# Altium schematic sheet TI_92_power.SchDoc: Power
size A; Organization: Altium Limited; Address1: L3, 12a Rodborough Rd; Address2: Frenchs Forest; Address3: NSW; Address4: Australia 2086; SheetNumber: 2
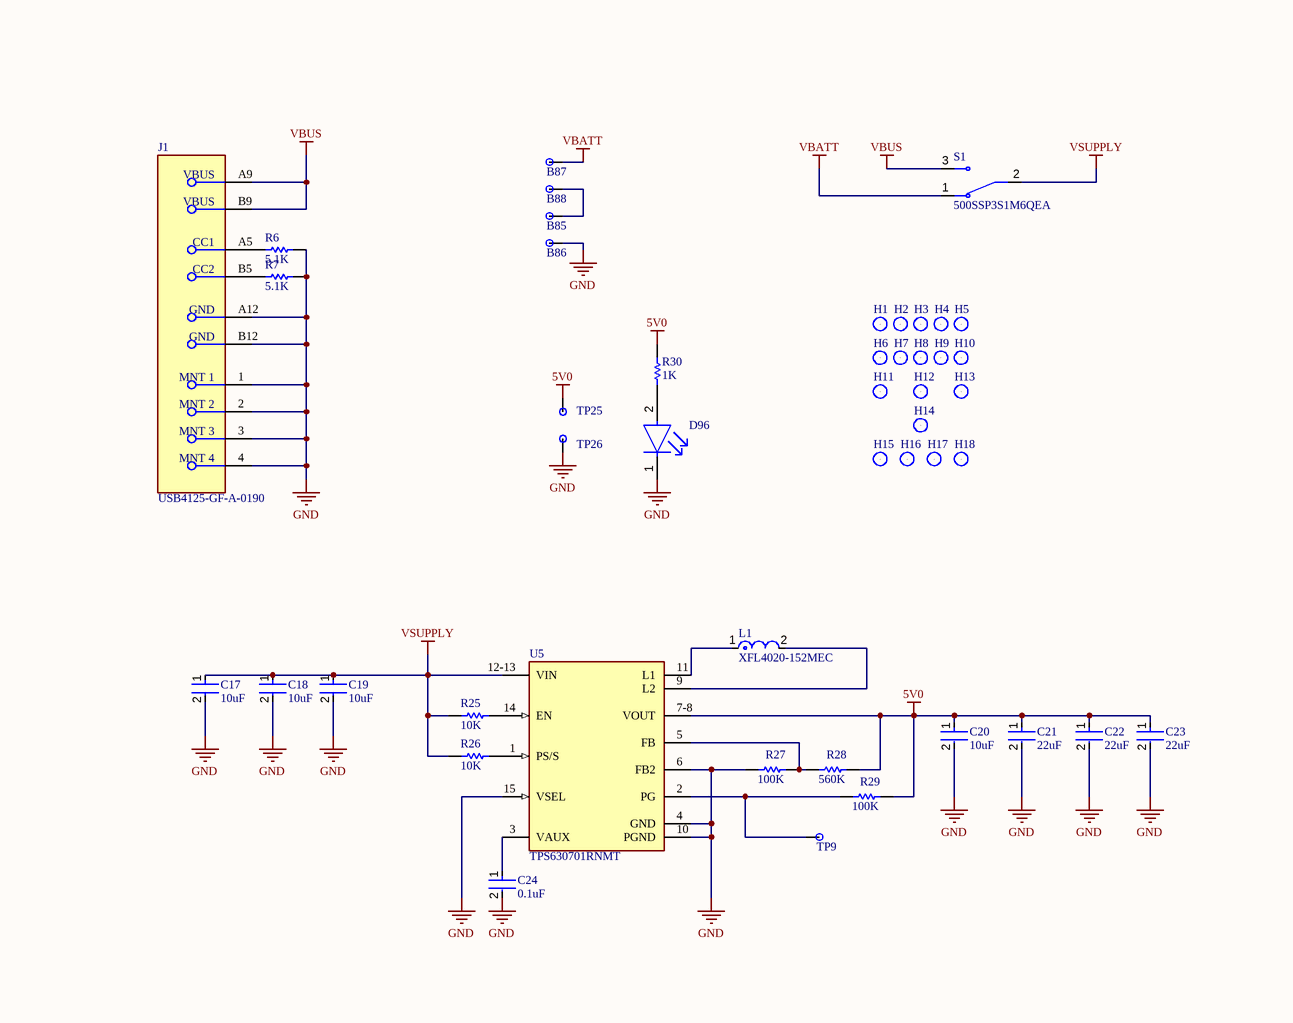
[diagram p0: TI_92_power.SchDoc]

## Parts
B85  Test Pad  [10mm_x_10mm_PAD]  (value not drawn)
B86  Test Pad  [10mm_x_8mm_PAD]  (value not drawn)
B87  Test Pad  [10mm_x_10mm_PAD]  (value not drawn)
B88  Test Pad  [10mm_x_8mm_PAD]  (value not drawn)
C17  10uF  [FP-GRM21B-0_2-e0_2_0_7-IPC_A]
C18  10uF  [FP-GRM21B-0_2-e0_2_0_7-IPC_A]
C19  10uF  [FP-0603-L_1_6_0_2-W_0_8_0-MFG]
C20  10uF  [FP-0603-L_1_6_0_2-W_0_8_0-MFG]
C21  22uF  [FP-GRM21B-0_2-e0_2_0_7-MFG]
C22  22uF  [FP-GRM21B-0_2-e0_2_0_7-MFG]
C23  22uF  [FP-GRM21B-0_2-e0_2_0_7-MFG]
C24  0.1uF  [FP-0402-L_1_0_0_05-W_0_5-IPC_B]
D96  APHHS1005CGCK  [FP-APHHS1005CGCK-MFG]  (value not drawn)
H1  Mounting Hole  [2.7mm_HOLE]  (value not drawn)
H2  Mounting Hole  [2.7mm_HOLE]  (value not drawn)
H3  Mounting Hole  [1.5mm_hole]  (value not drawn)
H4  Mounting Hole  [2.7mm_HOLE]  (value not drawn)
H5  Mounting Hole  [2.7mm_HOLE]  (value not drawn)
H6  Mounting Hole  [2.7mm_HOLE]  (value not drawn)
H7  Mounting Hole  [2.7mm_HOLE]  (value not drawn)
H8  Mounting Hole  [2.7mm_HOLE]  (value not drawn)
H9  Mounting Hole  [2.7mm_HOLE]  (value not drawn)
H10  Mounting Hole  [2.7mm_HOLE]  (value not drawn)
H11  Mounting Hole  [2.4mm_HOLE]  (value not drawn)
H12  Mounting Hole  [2.4mm_HOLE]  (value not drawn)
H13  Mounting Hole  [2.4mm_HOLE]  (value not drawn)
H14  Mounting Hole  [1.5mm_hole]  (value not drawn)
H15  Mounting Hole  [3.1mm_HOLE]  (value not drawn)
H16  Mounting Hole  [3.1mm_HOLE]  (value not drawn)
H17  Mounting Hole  [3.1mm_HOLE]  (value not drawn)
H18  Mounting Hole  [3.1mm_HOLE]  (value not drawn)
J1  USB4125-GF-A-0190  [FP-USB4125-GF-A-0190-MFG]
L1  XFL4020-152MEC  [FP-XFL4020-MFG]
R6  5.1K  [RESC1005X40X25NL05T10]
R7  5.1K  [RESC1005X40X25NL05T10]
R25  10K  [RESC1005X40X25NL05T10]
R26  10K  [RESC1005X40X25NL05T10]
R27  100K  [RESC1005X40X25NL05T10]
R28  560K  [RESC1005X40X25NL05T10]
R29  100K  [RESC1005X40X25NL05T10]
R30  1K  [RESC1005X40X25NL05T10]
S1  500SSP3S1M6QEA  [SW_500SSP3S1M6QEA]
TP9  Test Pad  [1.5MM_PAD]  (value not drawn)
TP25  Test Pad  [2.5MM_PAD]  (value not drawn)
TP26  Test Pad  [2.5MM_PAD]  (value not drawn)
U5  TPS630701RNMT  [FP-RNM0015A-MFG]

## Nets
5V0: C20.1 C21.1 C22.1 C23.1 R28.2 R29.2 R30.2 TP25.1(PAD) U5.7-8(VOUT)
GND: B86.1(PAD) C17.2 C18.2 C19.2 C20.2 C21.2 C22.2 C23.2 C24.2 D96.1(C) J1.1(MNT_1) J1.2(MNT_2) J1.3(MNT_3) J1.4(MNT_4) J1.A12(GND) J1.B12(GND) R6.1 R7.1 R27.1 TP26.1(PAD) U5.4(GND) U5.6(FB2) U5.10(PGND) U5.15(VSEL)
VBATT: B87.1(PAD) S1.1(NC)
VBUS: J1.A9(VBUS) J1.B9(VBUS) S1.3(NO)
VSUPPLY: C17.1 C18.1 C19.1 R25.2 R26.2 S1.2(COM) U5.12-13(VIN)
NetB85_1: B85.1(PAD) B88.1(PAD)
NetC24_1: C24.1 U5.3(VAUX)
NetD96_2: D96.2(A) R30.1
NetJ1_A5: J1.A5(CC1) R6.2
NetJ1_B5: J1.B5(CC2) R7.2
NetL1_1: L1.1 U5.11(L1)
NetL1_2: L1.2 U5.9(L2)
NetR25_1: R25.1 U5.14(EN)
NetR26_1: R26.1 U5.1(PS/S)
NetR27_2: R27.2 R28.1 U5.5(FB)
NetR29_1: R29.1 TP9.1(PAD) U5.2(PG)

Not connected (* = marked no-connect by the designer): H1 1(HOLE); H2 1(HOLE); H3 1(HOLE); H4 1(HOLE); H5 1(HOLE); H6 1(HOLE); H7 1(HOLE); H8 1(HOLE); H9 1(HOLE); H10 1(HOLE); H11 1(HOLE); H12 1(HOLE); H13 1(HOLE); H14 1(HOLE); H15 1(HOLE); H16 1(HOLE); H17 1(HOLE); H18 1(HOLE)

## Notes on the sheet
- DWG. NO.
- REV.
- SHT.
- THIS DOCUMENT AND THE DATA DISCLOSED HEREIN OR HEREWITH IS THE PROPERTY OF ALTIUM LIMITED AND MAY BE FREELY DISTRIBUTED IN WHOLE. NO RIGHTS ARE RESERVED OR EXPRESS OR IMPLIED WARANTEE GIVEN.
- REVISION
- DESCRIPTION
- DATE
- APPROVED
- ENG:
- APPROVALS
- PROJECT
- DSN:
- CHK:
- REFERENCE DOCUMENTS
- PROJECT REVISION:
- TITLE
- DOCUMENT REVISION:
- DESIGN ITEM:
- BOM:
- FAB DWG:
- PCB DWG:
- ASSY DWG:
- SCALE:
- SIZE
- B
- CAGE CODE
- FILE NAME
- DWG NO.
- SHEET
- OF
- REV

## Library data of the parts
B85-B88 TP9 TP25 TP26 = Test_Pad: Various Test Pads
C17 C18 = CMP-06035-056773-1: Chip Multilayer Ceramic Capacitors for General Purpose, 0805, 10uF, X7S, 22%, 20%, 25V; Case/Package: 0805; Min Operating Temperature: -55°C; Packaging: Tape and Reel; Height: 1.25mm; Thickness: 0.057inch; Weight: 0.000335oz; Termination: SMD/SMT; Capacitance: 10uF; Max Operating Temperature: 125°C; Length: 0.079inch; Dielectric: X7S; Mount: Surface Mount; Voltage Rating (DC): 25V; Case Code (Imperial): 0805; Case Code (Metric): 2012; Voltage Rating: 25V; Tolerance: 20%; Package Quantity: 3000; Width: 0.049inch
C19 C20 = CMP-14477-005164-2: Multilayer Ceramic Capacitor 10uF 25V X5R 20% SMD 0603 T/R; Capacitance: 10uF; Packaging: Tape and Reel; Tolerance: 20%; Mount: Surface Mount; Case Code (Metric): 1608; Case Code (Imperial): 0603; Min Operating Temperature: -55°C; Lead Free: Lead Free; RoHS Compliant: Yes; Case/Package: 0603; Max Operating Temperature: 85°C; Voltage Rating: 25V
C21-C23 = CMP-06035-012913-1: Chip Multilayer Ceramic Capacitors for General Purpose, 0805, 22uF, X6S, 22%, 20%, 16V; Packaging: Tape and Reel; Dielectric: X6S; Case Code (Imperial): 0805; Weight: 0.000335oz; Case Code (Metric): 2012; Thickness: 0.057inch; Min Operating Temperature: -55°C; Voltage Rating (DC): 16V; Tolerance: 20%; Width: 1.25mm; Voltage Rating: 16V; Mount: Surface Mount; Capacitance: 22uF; Length: 0.079inch; Lead Free: Lead Free; Case/Package: 0805; Package Quantity: 3000; Height: 1.25mm; Max Operating Temperature: 105°C; Termination: SMD/SMT
C24 = CMP-14477-003834-2: None; Capacitance: 100nF; Voltage Rating: 25V; Tolerance: 20%; Min Operating Temperature: -55°C; Max Operating Temperature: 125°C; Mount: Surface Mount; RoHS Compliant: Yes; Case/Package: 0402; Packaging: Tape and Reel
D96 = CMP-44529-000044-1: LED GREEN CLEAR CHIP SMD; Viewing Angle: 120°; Dominant Wavelength: 570nm; Test Current: 20mA; Luminous Intensity: 50mcd; Forward Voltage: 2.1V; Number of LEDs: 1; Lens Color: Clear; Packaging: Tape and Reel; Max Operating Temperature: 85°C; Illumination Color: Green; Length: 1mm; Mount: Surface Mount; Lens Style: Clear; Color: Green; Number of Pins: 2; Wavelength: 570nm; Case/Package: 0402; Width: 0.5mm; Package Quantity: 2000; Case Code (Metric): 1005; Height: 0.6mm; Lead Free: Lead Free; Case Code (Imperial): 0402; Forward Current: 20mA; Min Operating Temperature: -40°C
H1-H18 = Mounting_Hole: Various Mounting Holes
J1 = CMP-245163-000004-1: CONN RCPT TYPE C 6P SMD RA
L1 = CMP-11268-000104-1: Inductor Power Shielded Wirewound 1.5uH 20% 100KHz 9.1A 15.8mOhm DCR 1515 Automotive Embossed Plastic T/R; Core Material: Composite; DC Resistance (DCR): 15.8mR; Saturation Current: 4.1A; Self Resonant Frequency: 59MHz; Tolerance: 20%; Inductance: 1.5uH; Max DC Current: 9.1A; RoHS Compliant: Yes; Max Operating Temperature: 125°C; Length: 4.3mm; Case/Package: SMD/SMT; Mount: Surface Mount; Shielding: Shielded; Min Operating Temperature: -40°C; RMS Current (Irms): 9.1A; Test Frequency: 100kHz; Inductance Tolerance: 20%; REACH SVHC: No SVHC; Packaging: Tape and Reel; Termination: SMD/SMT; Lead Free: Contains Lead; Width: 4.3mm; Series: XFL4020; Height: 2.1mm
R6 R7 R25-R30 = CMP-2002-07472-1: Part Number: RC0402FR-071KL; Manufacturer: Yageo / Phycomp
U5 = CMP-04918-000497-1: IC REG BCK BST 5V 2A 15VQFN; Max Input Voltage: 16V; Switching Frequency: 2.4MHz; Min Input Voltage: 2V; Quiescent Current: 50uA; Topology: Buck-Boost; Output Current: 2A; Number of Pins: 15; Max Operating Temperature: 125°C; Packaging: Cut Tape; Nominal Output Voltage: 5V; REACH SVHC: No SVHC; RoHS Compliant: Yes; Lead Free: Lead Free
S1 = 500SSP3S1M6QEA: Price: None; MP: 500SSP3S1M6QEA; Availability: Unavailable; Value: *; Package: None